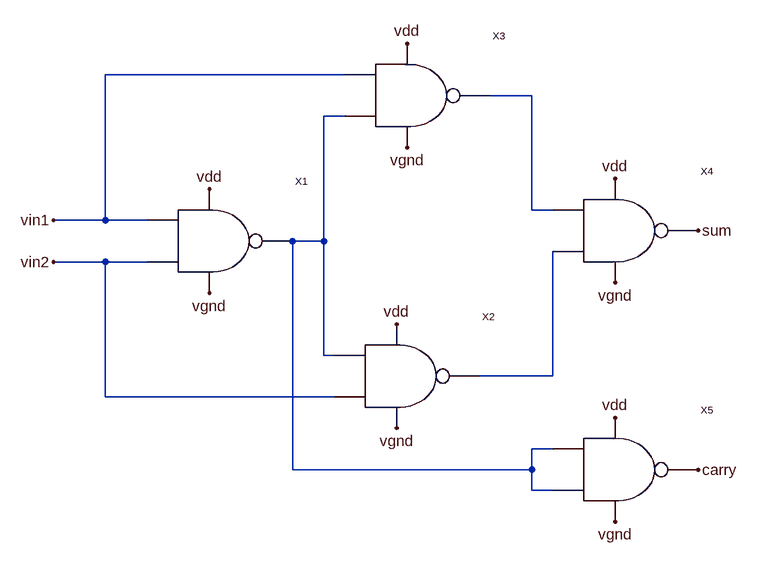
[diagram p0: schematic halfadder.asc]
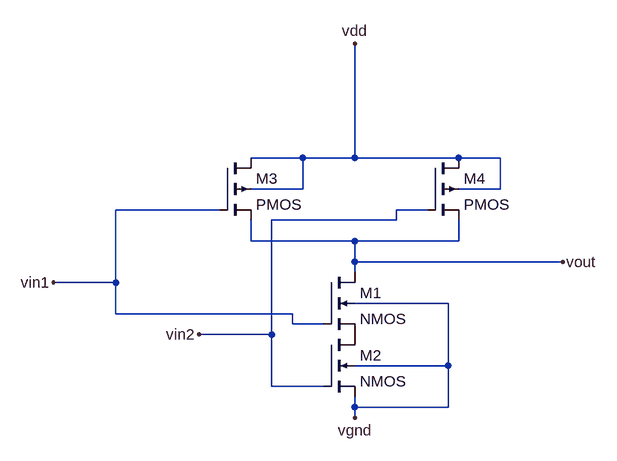
[diagram p1: sub-circuit cmos_nand.asc]
halfadder.asc, the LTspice schematic file:
Version 4
SHEET 1 924 680
WIRE 304 -128 -64 -128
WIRE 592 -96 528 -96
WIRE 304 -64 272 -64
WIRE 592 80 592 -96
WIRE 624 80 592 80
WIRE -64 96 -64 -128
WIRE -64 96 -144 96
WIRE 0 96 -64 96
WIRE 272 128 272 -64
WIRE 272 128 224 128
WIRE -64 160 -144 160
WIRE 0 160 -64 160
WIRE 272 304 272 128
WIRE 288 304 272 304
WIRE 624 336 624 144
WIRE 624 336 512 336
WIRE -64 368 -64 160
WIRE 288 368 -64 368
WIRE 624 448 592 448
WIRE 224 480 224 128
WIRE 592 480 592 448
WIRE 592 480 224 480
WIRE 592 512 592 480
WIRE 624 512 592 512
FLAG 400 -176 vdd
FLAG 400 -16 vgnd
FLAG 96 48 vdd
FLAG 96 208 vgnd
FLAG 384 256 vdd
FLAG 384 416 vgnd
FLAG 720 192 vgnd
FLAG 720 32 vdd
FLAG 848 112 sum
FLAG 848 480 carry
FLAG 720 400 vdd
FLAG 720 560 vgnd
FLAG -144 96 vin1
FLAG -144 160 vin2
SYMBOL cmos_nand 96 128 R0
SYMATTR InstName X1
SYMBOL cmos_nand 384 336 R0
SYMATTR InstName X2
SYMBOL cmos_nand 400 -96 R0
SYMATTR InstName X3
SYMBOL cmos_nand 720 112 R0
SYMATTR InstName X4
SYMBOL cmos_nand 720 480 R0
SYMATTR InstName X5

cmos_nand.asc, the sub-circuit schematic file:
Version 4
SHEET 1 880 680
WIRE 112 -96 32 -96
WIRE 192 -96 192 -272
WIRE 192 -96 112 -96
WIRE 352 -96 192 -96
WIRE 416 -96 352 -96
WIRE 112 -48 112 -96
WIRE 112 -48 32 -48
WIRE 416 -48 416 -96
WIRE 416 -48 352 -48
WIRE -16 -16 -176 -16
WIRE 304 -16 256 -16
WIRE 256 0 256 -16
WIRE 256 0 64 0
WIRE 32 32 32 0
WIRE 192 32 32 32
WIRE 352 32 352 0
WIRE 352 32 192 32
WIRE 192 64 192 32
WIRE 512 64 192 64
WIRE 192 80 192 64
WIRE -176 96 -176 -16
WIRE -176 96 -272 96
WIRE 336 128 192 128
WIRE -176 144 -176 96
WIRE 96 144 -176 144
WIRE 96 160 96 144
WIRE 144 160 96 160
WIRE 64 176 64 0
WIRE 64 176 -48 176
WIRE 336 224 336 128
WIRE 336 224 192 224
WIRE 64 256 64 176
WIRE 144 256 64 256
WIRE 192 288 192 272
WIRE 336 288 336 224
WIRE 336 288 192 288
WIRE 192 304 192 288
FLAG 512 64 vout
FLAG 192 -272 vdd
FLAG -272 96 vin1
FLAG -48 176 vin2
FLAG 192 304 vgnd
SYMBOL nmos4 144 80 R0
SYMATTR InstName M1
SYMBOL nmos4 144 176 R0
SYMATTR InstName M2
SYMBOL pmos4 -16 -96 R0
SYMATTR InstName M3
SYMBOL pmos4 304 -96 R0
SYMATTR InstName M4

The netlist it stands for:
* halfadder.asc
XX1 vin1 vin2 N002 vdd vgnd cmos_nand
XX2 N002 vin2 N003 vdd vgnd cmos_nand
XX3 vin1 N002 N001 vdd vgnd cmos_nand
XX4 N001 N003 sum vdd vgnd cmos_nand
XX5 N002 N002 carry vdd vgnd cmos_nand

* block symbol definitions
.subckt cmos_nand vin1 vin2 vout vdd vgnd
M1 vout vin1 P001 vgnd NMOS
M2 P001 vin2 vgnd vgnd NMOS
M3 vdd vin1 vout vdd PMOS
M4 vdd vin2 vout vdd PMOS
.ends cmos_nand

.model NMOS NMOS
.model PMOS PMOS
.lib standard.mos
.backanno
.end